# Altium schematic sheet Main_Fly_V1.0.0.SchDoc
size A3
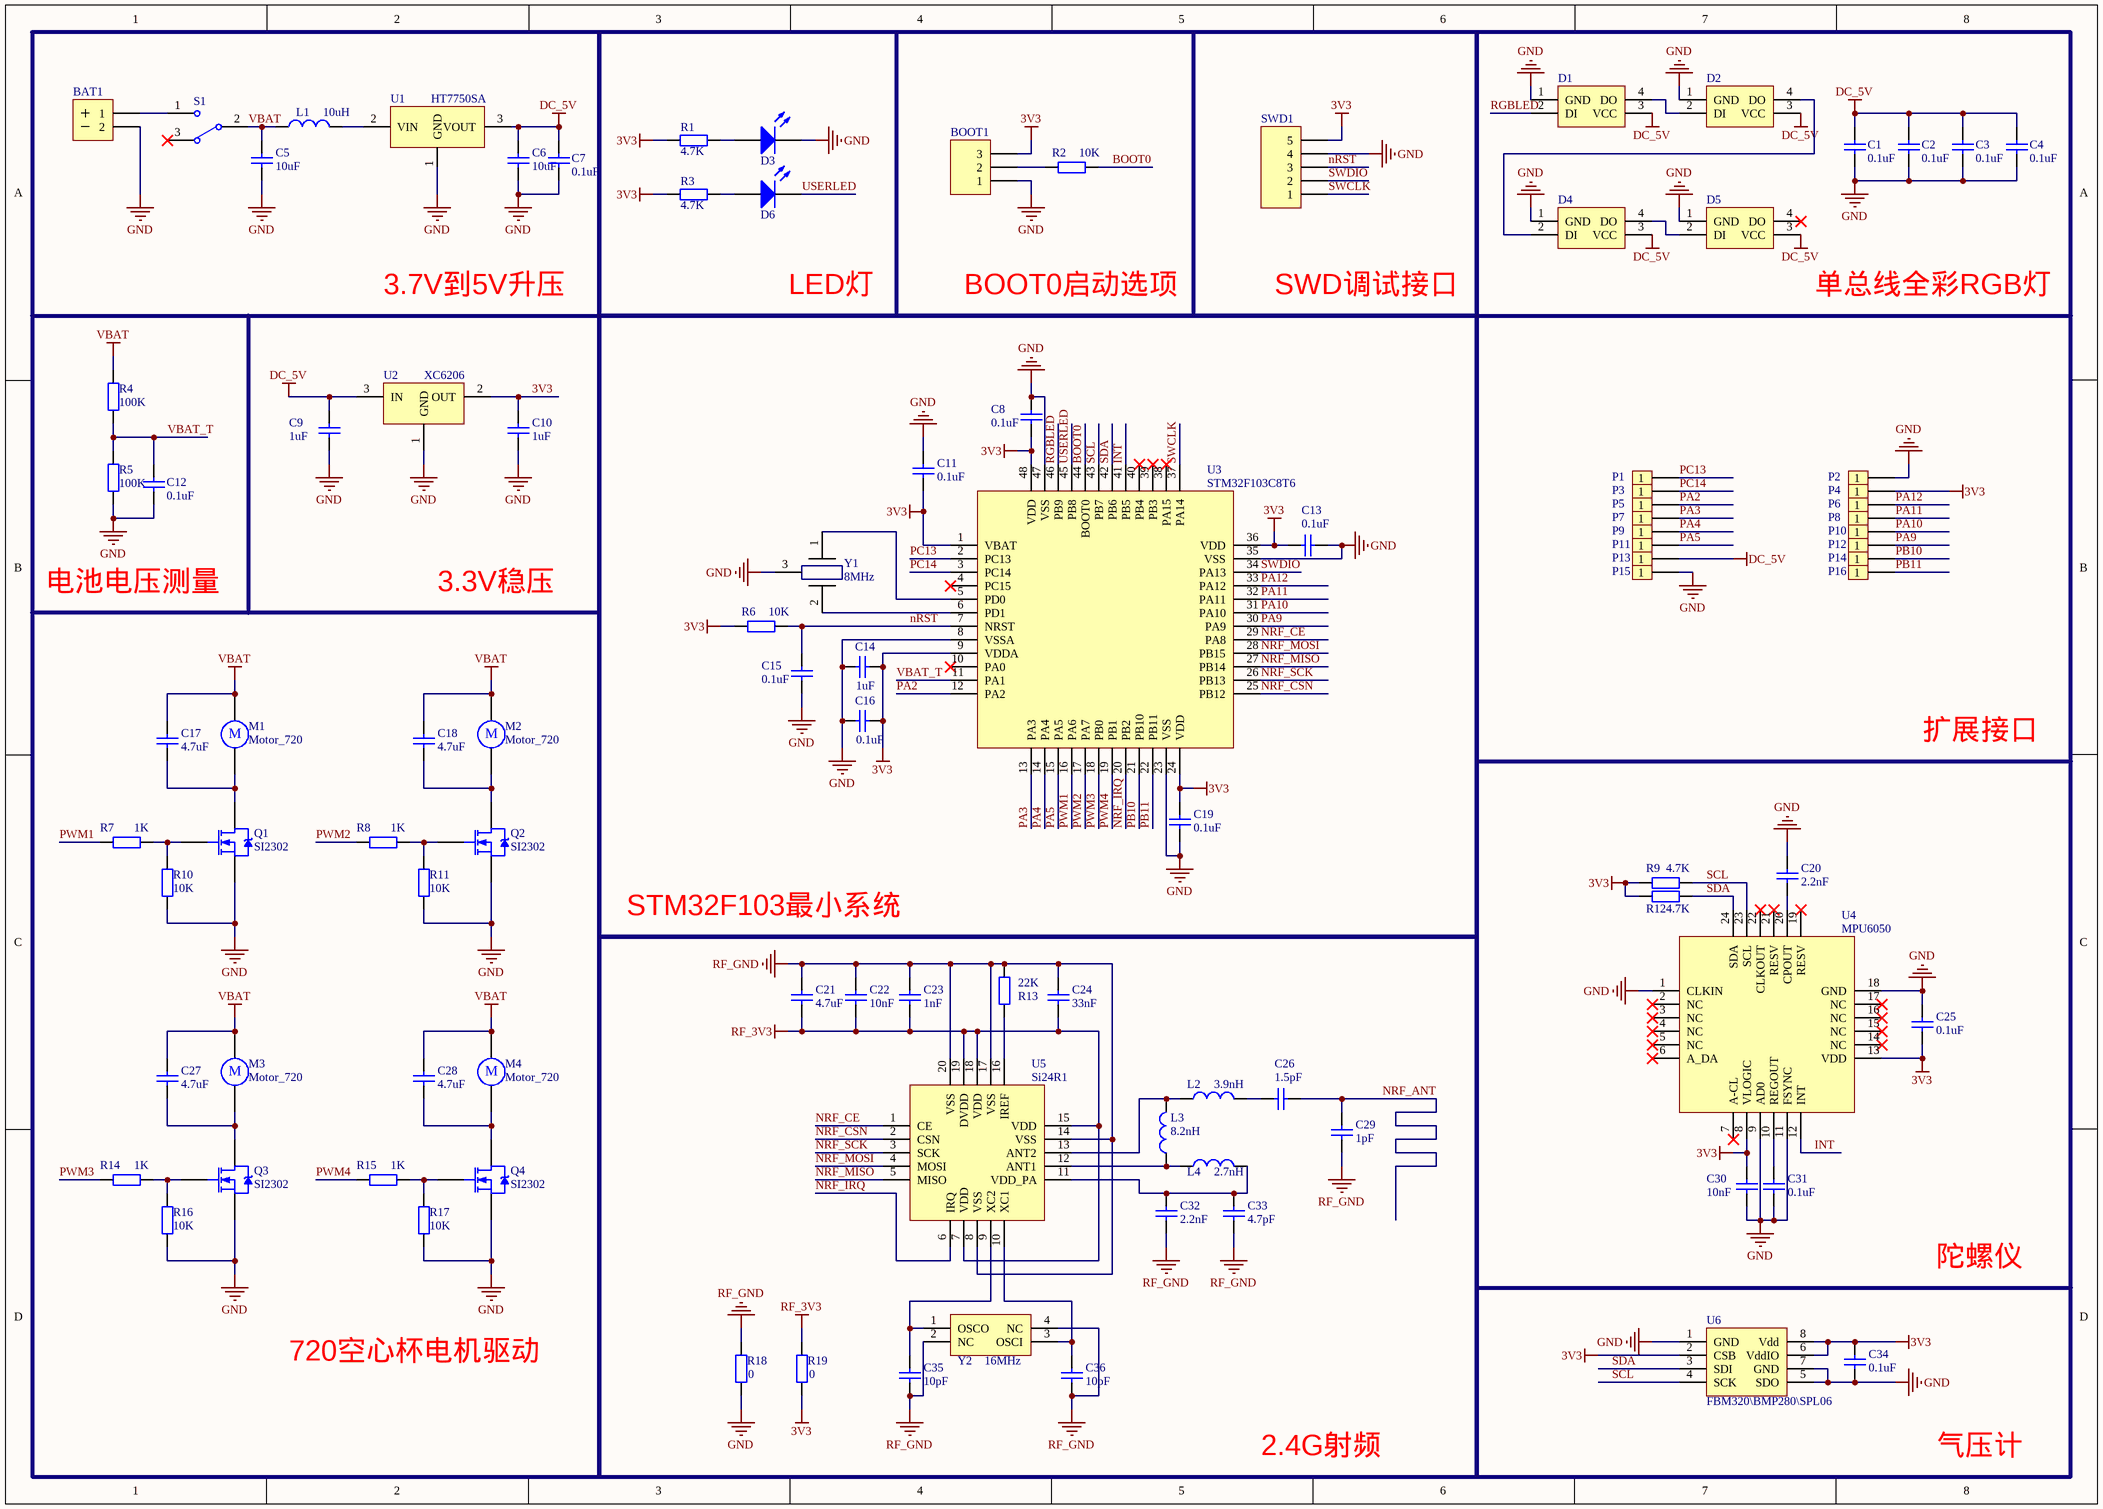
[diagram p0: Main_Fly_V1.0.0.SchDoc]

## Parts
BAT1  BAT  [HDR1X2]  (value not drawn)
BOOT1  BOOT  [HDR1X3]  (value not drawn)
C1  value 0.1uF  [C0603]  (hidden comment: C_0603)
C2  value 0.1uF  [C0603]  (hidden comment: C_0603)
C3  value 0.1uF  [C0603]  (hidden comment: C_0603)
C4  value 0.1uF  [C0603]  (hidden comment: C_0603)
C5  value 10uF  [C0603]  (hidden comment: C_0603)
C6  value 10uF  [C0603]  (hidden comment: C_0603)
C7  value 0.1uF  [C0603]  (hidden comment: C_0603)
C8  value 0.1uF  [C0603]  (hidden comment: C_0603)
C9  value 1uF  [C0603]  (hidden comment: C_0603)
C10  value 1uF  [C0603]  (hidden comment: C_0603)
C11  value 0.1uF  [C0603]  (hidden comment: C_0603)
C12  value 0.1uF  [C0603]  (hidden comment: C_0603)
C13  value 0.1uF  [C0603]  (hidden comment: C_0603)
C14  value 1uF  [C0603]  (hidden comment: C_0603)
C15  value 0.1uF  [C0603]  (hidden comment: C_0603)
C16  value 0.1uF  [C0603]  (hidden comment: C_0603)
C17  value 4.7uF  [C0603]  (hidden comment: C_0603)
C18  value 4.7uF  [C0603]  (hidden comment: C_0603)
C19  value 0.1uF  [C0603]  (hidden comment: C_0603)
C20  value 2.2nF  [C0603]  (hidden comment: C_0603)
C21  value 4.7uF  [C0603]  (hidden comment: C_0603)
C22  value 10nF  [C0603]  (hidden comment: C_0603)
C23  value 1nF  [C0603]  (hidden comment: C_0603)
C24  value 33nF  [C0603]  (hidden comment: C_0603)
C25  value 0.1uF  [C0603]  (hidden comment: C_0603)
C26  value 1.5pF  [C0603]  (hidden comment: C_0603)
C27  value 4.7uF  [C0603]  (hidden comment: C_0603)
C28  value 4.7uF  [C0603]  (hidden comment: C_0603)
C29  value 1pF  [C0603]  (hidden comment: C_0603)
C30  value 10nF  [C0603]  (hidden comment: C_0603)
C31  value 0.1uF  [C0603]  (hidden comment: C_0603)
C32  value 2.2nF  [C0603]  (hidden comment: C_0603)
C33  value 4.7pF  [C0603]  (hidden comment: C_0603)
C34  value 0.1uF  [C0603]  (hidden comment: C_0603)
C35  value 10pF  [C0603]  (hidden comment: C_0603)
C36  value 10pF  [C0603]  (hidden comment: C_0603)
D1  P923D  [RGB_LED_5050]  (value not drawn)
D2  P923D  [RGB_LED_5050]  (value not drawn)
D3  LED_0603  [LED0603-green]  (value not drawn)
D4  P923D  [RGB_LED_5050]  (value not drawn)
D5  P923D  [RGB_LED_5050]  (value not drawn)
D6  LED_0603  [LED0603-green]  (value not drawn)
L1  value 10uH  [L_1812]  (hidden comment: Inductor)
L2  value 3.9nH  [C0603]  (hidden comment: Inductor)
L3  value 8.2nH  [C0603]  (hidden comment: Inductor)
L4  value 2.7nH  [C0603]  (hidden comment: Inductor)
M1  Motor_720  [MOTOR]
M2  Motor_720  [MOTOR]
M3  Motor_720  [MOTOR]
M4  Motor_720  [MOTOR]
P1  Header 1  [HEADER1]  (value not drawn)
P2  Header 1  [HEADER1]  (value not drawn)
P3  Header 1  [HEADER1]  (value not drawn)
P4  Header 1  [HEADER1]  (value not drawn)
P5  Header 1  [HEADER1]  (value not drawn)
P6  Header 1  [HEADER1]  (value not drawn)
P7  Header 1  [HEADER1]  (value not drawn)
P8  Header 1  [HEADER1]  (value not drawn)
P9  Header 1  [HEADER1]  (value not drawn)
P10  Header 1  [HEADER1]  (value not drawn)
P11  Header 1  [HEADER1]  (value not drawn)
P12  Header 1  [HEADER1]  (value not drawn)
P13  Header 1  [HEADER1]  (value not drawn)
P14  Header 1  [HEADER1]  (value not drawn)
P15  Header 1  [HEADER1]  (value not drawn)
P16  Header 1  [HEADER1]  (value not drawn)
Q1  SI2302  [SOT-23-3]
Q2  SI2302  [SOT-23-3]
Q3  SI2302  [SOT-23-3]
Q4  SI2302  [SOT-23-3]
R1  value 4.7K  [R0603 - 1]  (hidden comment: R_0603)
R2  value 10K  [R0603 - 1]  (hidden comment: R_0603)
R3  value 4.7K  [R0603 - 1]  (hidden comment: R_0603)
R4  value 100K  [R0603 - 1]  (hidden comment: R_0603)
R5  value 100K  [R0603 - 1]  (hidden comment: R_0603)
R6  value 10K  [R0603 - 1]  (hidden comment: R_0603)
R7  value 1K  [R0603 - 1]  (hidden comment: R_0603)
R8  value 1K  [R0603 - 1]  (hidden comment: R_0603)
R9  value 4.7K  [R0603 - 1]  (hidden comment: R_0603)
R10  value 10K  [R0603 - 1]  (hidden comment: R_0603)
R11  value 10K  [R0603 - 1]  (hidden comment: R_0603)
R12  value 4.7K  [R0603 - 1]  (hidden comment: R_0603)
R13  value 22K  [R0603 - 1]  (hidden comment: R_0603)
R14  value 1K  [R0603 - 1]  (hidden comment: R_0603)
R15  value 1K  [R0603 - 1]  (hidden comment: R_0603)
R16  value 10K  [R0603 - 1]  (hidden comment: R_0603)
R17  value 10K  [R0603 - 1]  (hidden comment: R_0603)
R18  value 0  [R0603 - 1]  (hidden comment: R_0603)
R19  value 0  [R0603 - 1]  (hidden comment: R_0603)
S1  SW-SPDT  [SWITCH_PWR]  (value not drawn)
SWD1  SWD  [HDR1X5]  (value not drawn)
U1  HT7750SA  [SOT-89(SOT-89-3)]
U2  XC6206  [SOT-23-3]
U3  STM32F103C8T6  [LC-LQFP-48_7x7x05P]
U4  MPU6050  [QFN-24_4x4x05P]
U5  Si24R1  [QFN-20_4x4]
U6  FBM320\BMP280\SPL06  [LGA-2_5X2MM]
Y1  value 8MHz  [SMD-cstse800G52-r0]  (hidden comment: XTAL)
Y2  value 16MHz  [CRYSTAL_RSX-10]  (hidden comment: XTAL)

## Nets
3V3: BOOT1.3 C8.1 C10.1 C11.2 C13.2 C14.2 C16.2 C19.1 C25.2 C30.2 C34.1 P4.1 R1.1 R3.1 R6.2 R9.1 R12.1 R19.1 SWD1.5 U2.2(OUT) U3.1(VBAT) U3.9(VDDA) U3.24(VDD) U3.36(VDD) U3.48(VDD) U4.8(VLOGIC) U4.13(VDD) U6.2(CSB) U6.6(VddIO) U6.8(Vdd)
DC_5V: C1.2 C2.2 C3.2 C4.2 C6.1 C7.2 C9.2 D1.3(VCC) D2.3(VCC) D4.3(VCC) D5.3(VCC) P13.1 U1.3(VOUT) U2.3(IN)
GND: BAT1.2 BOOT1.1 C1.1 C2.1 C3.1 C4.1 C5.2 C6.2 C7.1 C8.2 C9.1 C10.2 C11.1 C12.1 C13.1 C14.1 C15.1 C16.1 C19.2 C20.1 C25.1 C30.1 C31.2 C34.2 D1.1(GND) D2.1(GND) D3.2 D4.1(GND) D5.1(GND) P2.1 P15.1 Q1.2(S) Q2.2(S) Q3.2(S) Q4.2(S) R5.1 R10.1 R11.1 R16.1 R17.1 R18.1 SWD1.4 U1.1(GND) U2.1(GND) U3.8(VSSA) U3.23(VSS) U3.35(VSS) U3.47(VSS) U4.1(CLKIN) U4.9(AD0) U4.11(FSYNC) U4.18(GND) U6.1(GND) U6.5(SDO) U6.7(GND) Y1.3
RF_3V3: C21.1 C22.1 C23.1 C24.1 R19.2 U5.7(VDD) U5.15(VDD) U5.18(VDD) U5.19(DVDD)
RF_GND: C21.2 C22.2 C23.2 C24.2 C29.1 C32.1 C33.1 C35.1 C36.1 R13.2 R18.2 U5.8(VSS) U5.14(VSS) U5.17(VSS) U5.20(VSS) Y2.2(NC) Y2.4(NC)
VBAT: C5.1 C17.2 C18.2 C27.2 C28.2 L1.1 M1.1 M2.1 M3.1 M4.1 R4.2 S1.2
BOOT0: R2.2 U3.44(BOOT0)
INT: U3.41(PB5) U4.12(INT)
NRF_ANT: C26.2 C29.2
NRF_CE: U3.29(PA8) U5.1(CE)
NRF_CSN: U3.25(PB12) U5.2(CSN)
NRF_IRQ: U3.20(PB2) U5.6(IRQ)
NRF_MISO: U3.27(PB14) U5.5(MISO)
NRF_MOSI: U3.28(PB15) U5.4(MOSI)
NRF_SCK: U3.26(PB13) U5.3(SCK)
nRST: C15.2 R6.1 SWD1.3 U3.7(NRST)
PA2: P5.1 U3.12(PA2)
PA3: P7.1 U3.13(PA3)
PA4: P9.1 U3.14(PA4)
PA5: P11.1 U3.15(PA5)
PA9: P12.1 U3.30(PA9)
PA10: P10.1 U3.31(PA10)
PA11: P8.1 U3.32(PA11)
PA12: P6.1 U3.33(PA12)
PB10: P14.1 U3.21(PB10)
PB11: P16.1 U3.22(PB11)
PC13: P1.1 U3.2(PC13)
PC14: P3.1 U3.3(PC14)
PWM1: R7.1 U3.16(PA6)
PWM2: R8.1 U3.17(PA7)
PWM3: R14.1 U3.18(PB0)
PWM4: R15.1 U3.19(PB1)
RGBLED: D1.2(DI) U3.46(PB9)
SCL: R9.2 U3.43(PB7) U4.23(SCL) U6.4(SCK)
SDA: R12.2 U3.42(PB6) U4.24(SDA) U6.3(SDI)
SWCLK: SWD1.1 U3.37(PA14)
SWDIO: SWD1.2 U3.34(PA13)
USERLED: D6.2 U3.45(PB8)
VBAT_T: C12.2 R4.1 R5.2 U3.11(PA1)
NetBAT1_1: BAT1.1 S1.1
NetBOOT1_2: BOOT1.2 R2.1
NetC17_1: C17.1 M1.2 Q1.3(D)
NetC18_1: C18.1 M2.2 Q2.3(D)
NetC20_2: C20.2 U4.20(CPOUT)
NetC26_1: C26.1 L2.2
NetC27_1: C27.1 M3.2 Q3.3(D)
NetC28_1: C28.1 M4.2 Q4.3(D)
NetC31_1: C31.1 U4.10(REGOUT)
NetC32_2: C32.2 C33.2 L4.2 U5.11(VDD_PA)
NetC35_2: C35.2 U5.9(XC2) Y2.1(OSCO)
NetC36_2: C36.2 U5.10(XC1) Y2.3(OSCI)
NetD1_4: D1.4(DO) D2.2(DI)
NetD2_4: D2.4(DO) D4.2(DI)
NetD3_1: D3.1 R1.2
NetD4_4: D4.4(DO) D5.2(DI)
NetD6_1: D6.1 R3.2
NetL1_2: L1.2 U1.2(VIN)
NetL2_1: L2.1 L3.2 U5.13(ANT2)
NetL3_1: L3.1 L4.1 U5.12(ANT1)
NetQ1_1: Q1.1(G) R7.2 R10.2
NetQ2_1: Q2.1(G) R8.2 R11.2
NetQ3_1: Q3.1(G) R14.2 R16.2
NetQ4_1: Q4.1(G) R15.2 R17.2
NetR13_1: R13.1 U5.16(IREF)
NetU3_5: U3.5(PD0) Y1.1
NetU3_6: U3.6(PD1) Y1.2

Not connected (* = marked no-connect by the designer): D5 4(DO)*; S1 3*; U3 4(PC15)* 10(PA0)* 38(PA15)* 39(PB3)* 40(PB4)*; U4 2(NC)* 3(NC)* 4(NC)* 5(NC)* 6(A_DA)* 7(A-CL)* 14(NC)* 15(NC)* 16(NC)* 17(NC)* 19(RESV)* 21(RESV)* 22(CLKOUT)*

## Notes on the sheet
- 3.7V到5V升压
- LED灯
- BOOT0启动选项
- SWD调试接口
- (near D5) 单总线全彩RGB灯
- 电池电压测量
- 3.3V稳压
- 扩展接口
- STM32F103最小系统
- 陀螺仪
- 720空心杯电机驱动
- 2.4G射频
- 气压计
- (in symbol Motor_720) M

## Library data of the parts
BAT1 = BAT: Header, 2-Pin; Publisher: mazhongwei; Published: 8-August-2017; PackageReference: HDR1X2
BOOT1 = Header 3: Header, 3-Pin; LatestRevisionDate: 17-Jul-2002; LatestRevisionNote: Re-released for DXP Platform.; Publisher: Altium Limited
D3 D6 = LED 0603: 发光二极管; Published: 8-Jun-2000; LatestRevisionDate: 08-Jul-2005; LatestRevisionNote: Mech Layer 1 removed.; PackageReference: LED-0; Publisher: Altium Limited; PackageDescription: LED; 2 Leads
L1 = Inductor: 电感; Code_IEC: 1005; Published: 8-Jun-2000; LatestRevisionDate: 17-Jul-2002; LatestRevisionNote: Re-released for DXP Platform.; PackageReference: 0402-A; Publisher: Altium Limited; Code_JEITA: 0402
L2-L4 = Inductor_1: 电感; Code_IEC: 1005; Published: 8-Jun-2000; LatestRevisionDate: 17-Jul-2002; LatestRevisionNote: Re-released for DXP Platform.; PackageReference: 0402-A; Publisher: Altium Limited; Code_JEITA: 0402
M1-M4 = Motor_720: Motor, General Kind; Published: 8-August-2017; PackageReference: RB5-10.5; Publisher: mazhongwei
Q1-Q4 = SI2302: N-Channel Power MOSFET; Published: 8-August-2017; PackageReference: SOT23-3; Publisher: mazhongwei
S1 = SW-SPDT: SPDT Subminiature Toggle Switch, Right Angle Mounting, Vertical Actuation; Published: 10-August-2017; PackageReference: SWITCH_PWR; Publisher: mazhongwei
SWD1 = Header 5: Header, 5-Pin; LatestRevisionDate: 17-Jul-2002; LatestRevisionNote: Re-released for DXP Platform.; Publisher: Altium Limited
U5 = nRF24L01
U6 = FBM320: 气压计; Published: 8-August-2017; Publisher: mazhongwei; PackageReference: LGA-2_5X2MM
Y1 = XTAL_2: Publisher: mazhongwei; Published: 8-August-2017; PackageReference: SMD-cstse800G52-r0
Y2 = XTAL16M
C1-C36 = C_0603: Published: 8-Jun-2000; LatestRevisionDate: 17-Jul-2002; LatestRevisionNote: Re-released for DXP Platform.; PackageReference: RAD-0.3; Publisher: Altium Limited; PackageDescription: Radial Cap, Thru-Hole; 2 Leads; 0.3 in Pin Spacing
D1 D2 D4 D5 = P923D: Publisher: mazhongwei; Published: 8-August-2017; PackageReference: RGB_LED_5050
P1-P16 = Header 1: LatestRevisionDate: 17-Jul-2002; LatestRevisionNote: Re-released for DXP Platform.; Publisher: Altium Limited
R1-R19 = R_0603: Published: 8-Jun-2000; LatestRevisionDate: 17-Jul-2002; LatestRevisionNote: Re-released for DXP Platform.; PackageReference: AXIAL-0.4; Publisher: Altium Limited; PackageDescription: Axial Device, Thru-Hole; 2 Leads; 0.4 in Pin Spacing
U2 = XC6206: PackageReference: SOT23-3; Published: 12-August-2017; Publisher: mazhongwei